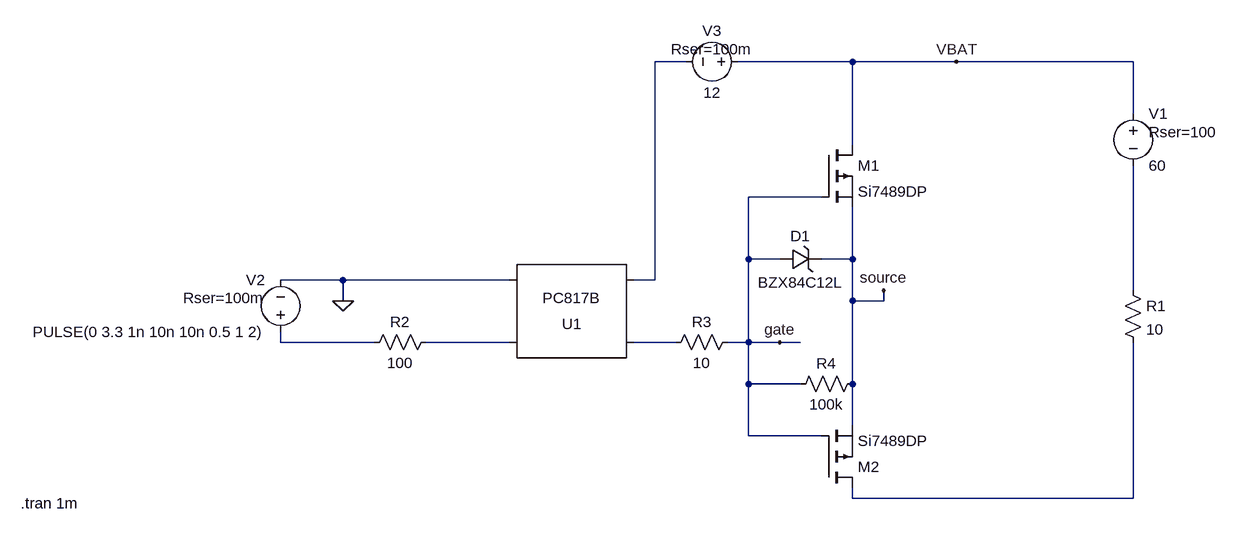
[diagram p0: schematic Draft2.asc]
Draft2.asc, the LTspice schematic file:
Version 4.1
SHEET 1 1108 680
WIRE -16 -224 -64 -224
WIRE 240 -224 64 -224
WIRE 400 -224 240 -224
WIRE 672 -224 400 -224
WIRE 672 -144 672 -224
WIRE 240 -96 240 -224
WIRE 192 -16 80 -16
WIRE 80 80 80 -16
WIRE 128 80 80 80
WIRE 240 80 240 0
WIRE 240 80 192 80
WIRE -544 112 -640 112
WIRE -288 112 -544 112
WIRE -64 112 -64 -224
WIRE -64 112 -96 112
WIRE 672 128 672 -64
WIRE -544 144 -544 112
WIRE 240 144 240 80
WIRE 288 144 288 128
WIRE 288 144 240 144
WIRE -640 208 -640 192
WIRE -496 208 -640 208
WIRE -288 208 -416 208
WIRE -32 208 -96 208
WIRE 80 208 80 80
WIRE 80 208 48 208
WIRE 128 208 80 208
WIRE 160 208 128 208
WIRE 80 272 80 208
WIRE 160 272 80 272
WIRE 240 272 240 144
WIRE 240 336 240 272
WIRE 80 352 80 272
WIRE 192 352 80 352
WIRE 240 448 240 432
WIRE 672 448 672 208
WIRE 672 448 240 448
FLAG -544 144 0
FLAG 128 208 gate
FLAG 288 128 source
FLAG 400 -224 VBAT
SYMBOL pmos 192 -96 R0
SYMATTR InstName M1
SYMATTR Value Si7489DP
SYMBOL voltage 672 -160 R0
WINDOW 123 0 0 Left 0
WINDOW 39 24 44 Left 2
SYMATTR SpiceLine Rser=100
SYMATTR InstName V1
SYMATTR Value 60
SYMBOL res 656 112 R0
SYMATTR InstName R1
SYMATTR Value 10
SYMBOL voltage -640 208 R180
WINDOW 0 24 96 Left 2
WINDOW 3 24 16 Left 2
WINDOW 123 0 0 Left 0
WINDOW 39 24 68 Left 2
SYMATTR InstName V2
SYMATTR Value PULSE(0 3.3 1n 10n 10n 0.5 1 2)
SYMATTR SpiceLine Rser=100m
SYMBOL res -400 192 R90
WINDOW 0 0 56 VBottom 2
WINDOW 3 32 56 VTop 2
SYMATTR InstName R2
SYMATTR Value 100
SYMBOL Optos\\PC817B -192 160 M180
SYMATTR InstName U1
SYMBOL res 64 192 R90
WINDOW 0 0 56 VBottom 2
WINDOW 3 32 56 VTop 2
SYMATTR InstName R3
SYMATTR Value 10
SYMBOL voltage 80 -224 R90
WINDOW 0 -32 56 VBottom 2
WINDOW 3 32 56 VTop 2
WINDOW 123 0 0 Left 0
WINDOW 39 -4 56 VBottom 2
SYMATTR InstName V3
SYMATTR Value 12
SYMATTR SpiceLine Rser=100m
SYMBOL zener 128 96 R270
WINDOW 0 36 32 VTop 2
WINDOW 3 -4 32 VBottom 2
SYMATTR InstName D1
SYMATTR Value BZX84C12L
SYMBOL res 256 256 R90
WINDOW 0 0 56 VBottom 2
WINDOW 3 32 56 VTop 2
SYMATTR InstName R4
SYMATTR Value 100k
SYMBOL pmos 192 432 M180
SYMATTR InstName M2
SYMATTR Value Si7489DP
TEXT -1040 456 Left 2 !.tran 1m

The netlist it stands for:
* Draft2.asc
M1 VBAT gate source source Si7489DP
V1 VBAT N002 60 Rser=100
R1 N002 N006 10
V2 N003 0 PULSE(0 3.3 1n 10n 10n 0.5 1 2) Rser=100m
R2 N004 N003 100
X§U1 N004 0 N005 N001 PC817 Igain=1.5m
R3 gate N005 10
V3 VBAT N001 12 Rser=100m
D1 gate source BZX84C12L
R4 source gate 100k
M2 N006 gate source source Si7489DP
.model D D
.lib standard.dio
.model NMOS NMOS
.model PMOS PMOS
.lib standard.mos
.tran 1m
.lib PC817.sub
.backanno
.end